# Altium schematic sheet Sheet1.SchDoc
size A; SheetNumber: 1; SheetTotal: 1
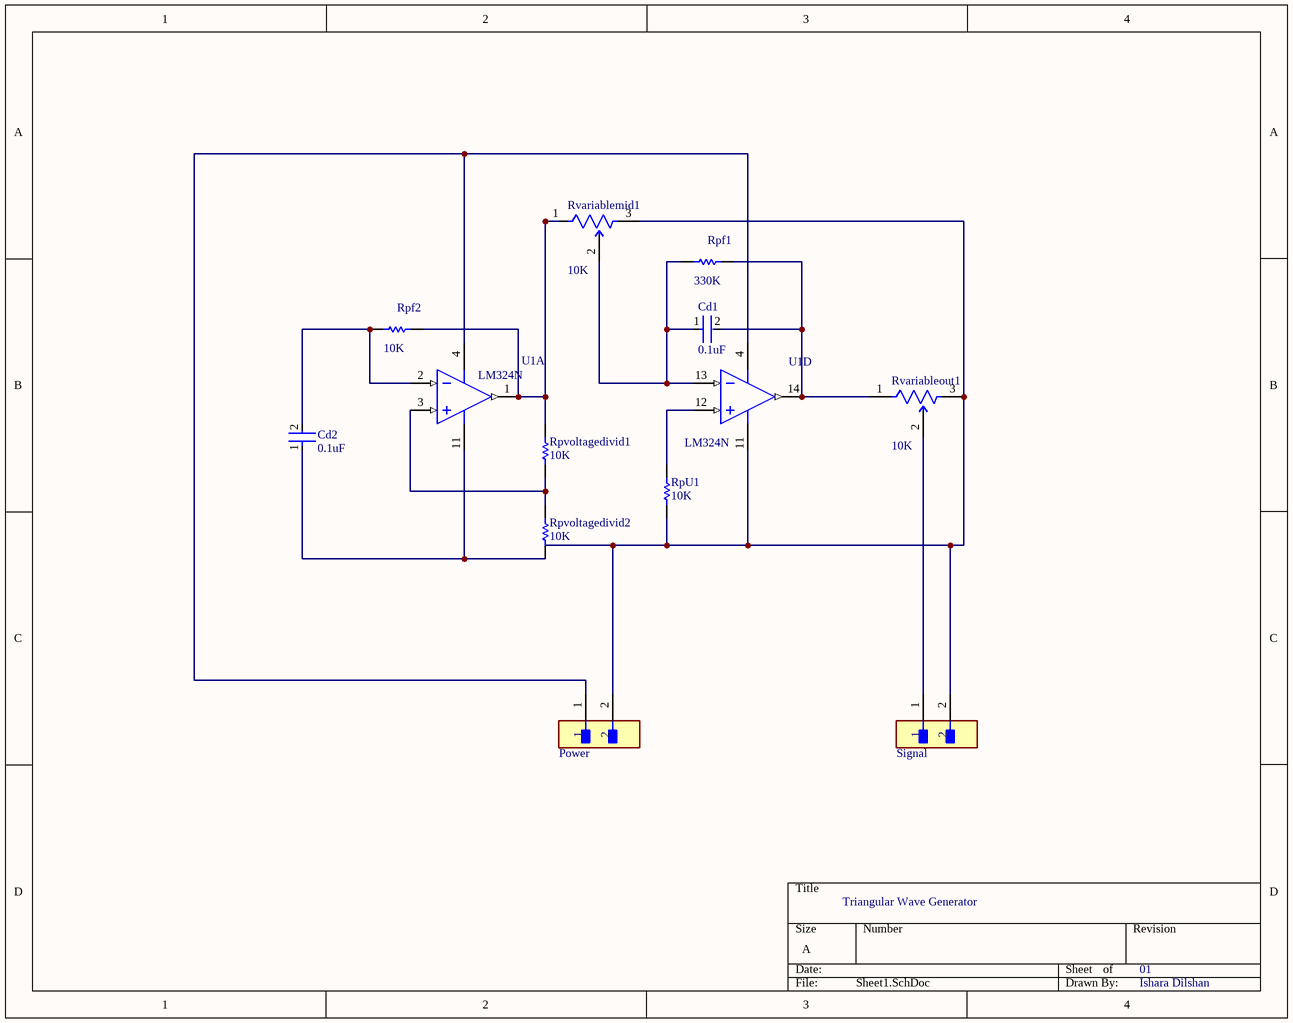
[diagram p0: Sheet1.SchDoc]

## Parts
Cd1  0.1uF  [FP-RCE0K1-MFG]
Cd2  0.1uF  [FP-RCE0K1-MFG]
Power  (no value)  [FP-B2B-XH-A_LF_SN-MFG]
Rpf1  330K  [OMTE-RES7X2.5-2]
Rpf2  10K  [OMTE-RES7X2.5-2]
RpU1  10K  [OMTE-RES7X2.5-2]
Rpvoltagedivid1  10K  [OMTE-RES7X2.5-2]
Rpvoltagedivid2  10K  [OMTE-RES7X2.5-2]
Rvariablemid1  10K  [FP-3296W-MFG]
Rvariableout1  10K  [FP-3296W-MFG]
Signal  (no value)  [FP-B2B-XH-A_LF_SN-MFG]
U1  LM324N  [N0014A]  (parts A,D of 4)

## Nets
NetCd1_1: Cd1.1 Rpf1.1 Rvariablemid1.2(WIPER) U1.13(IN4-)
NetCd1_2: Cd1.2 Rpf1.2 Rvariableout1.1(CCW) U1.14(OUT4)
NetCd2_1: Cd2.1 Rpvoltagedivid2.1 U1.11(GND)
NetCd2_2: Cd2.2 Rpf2.1 U1.2(IN1-)
NetPower_1: Power.1 U1.4(V+)
NetPower_2: Power.2 RpU1.1 Rvariablemid1.3(CW) Rvariableout1.3(CW) Signal.2 U1.11(GND)
NetRpf2_2: Rpf2.2 Rpvoltagedivid1.2 Rvariablemid1.1(CCW) U1.1(OUT1)
NetRpU1_2: RpU1.2 U1.12(IN4+)
NetRpvoltagedivid1_1: Rpvoltagedivid1.1 Rpvoltagedivid2.2 U1.3(IN1+)
NetRvariableout1_2: Rvariableout1.2(WIPER) Signal.1

## Notes on the sheet
- Triangular Wave Generator
- 01
- Ishara Dilshan

## Library data of the parts
Cd1 Cd2 = CMP-06035-026251-1: Cap Ceramic 27pF 50V C0G ±5% Radial 5mm +125°C Automotive Bulk; Lead Diameter: 0.5mm; Lead/Base Style: Formed Leads; Height: 3.5mm; Mount: Through Hole; Height - Seated (Max): 0.138inch; Min Operating Temperature: -55°C; Package Quantity: 1; Width: 0.098inch; Lead Pitch: 0.197inch; Capacitance: 27pF; Voltage Rating: 50V; Max Operating Temperature: 125°C; Case/Package: Radial; Termination: Radial; Voltage Rating (DC): 50V; Packaging: Tape and Reel; Tolerance: 5%; Resistor Type: Ceramic; Dielectric: C0G; Length: 0.142inch; Ratings: AEC-Q200
Power Signal = CMP-2000-05888-3: CONN HEADER VERT 2POS 2.5MM; Current Rating: 3A; Voltage Rating: 250V; Number of Contacts: 2; Contact Resistance: 20mR; Wire/Cable Gauge: 22AWG; Insulation Resistance: 1GR; Connector Type: Male Pin; Packaging: Bulk; Contact Material: Brass; Lead Free: Lead Free; Orientation: Straight; Contact Plating: Tin; Max Current Rating: 3A; Termination: Solder; Fastening Type: Detent; Depth: 5.75mm; Housing Material: Polyamide; REACH SVHC: No SVHC; Series: XH; Voltage Rating (AC): 250V; Number of Positions: 2; Color: Natural; Contact Type: Male Pin; Max Voltage Rating (DC): 250V; Pitch: 2.5mm; Lead Pitch: 2.5mm; Mount: Through Hole; Max Operating Temperature: 85°C; Length: 7.4mm; Max Voltage Rating (AC): 250V; Min Operating Temperature: -25°C; Number of Rows: 1; Housing Color: White
Rpf1 = CMP-2000-06865-1: Little Demon(R) Carbon Composition Molded OD Series, 250 V, 10 KOhm, +/-5%, -70 to 130 degC, 2-Pin THD, RoHS, Bulk; PartNumber: OD103JE; Manufacturer: Ohmite; Resistance (Ohms): 10k; Power Rating: 0.25W; Power (Watts): 0.25W,1/4W; Tolerance: ±5%; Online Catalog: OD,OF,OASeries,LittleDemon®; Catalog Drawings: OD,OF,OASeries; EDA / CAD Models: DownloadfromAcceleratedDesigns; Mounting Technology: ThroughHole; Datasheet Version: 06/2016; RoHS Information: LittleDemon"E"SeriesMaterialDeclaration; Number of Terminations: 2; Temperature Coefficient: -; Height: -; Composition: CarbonComposition; Package Description: 2-Pin THD Resistor, Body 7 x 2.5 mm, Lead Dia. 0.6 mm; Size / Dimension: 0.098"Diax0.276"L(2.50mmx7.00mm); Category: Resistors; Manufacturer URL: http://www.ohmite.com/; Features: PulseWithstanding; Family: ThroughHoleResistors; Supplier Device Package: Axial; Package / Case: Axial; Standard Package: 100; Package Reference: RES7X2.5; Operating Temperature: -; Series: LittleDemon®OD; Datasheet URL: http://www.ohmite.com/cat/res_od_of_oa.pdf; Packaging: Bulk
Rpf2 RpU1 Rpvoltagedivid1 Rpvoltagedivid2 = CMP-2000-06865-1: Little Demon(R) Carbon Composition Molded OD Series, 250 V, 10 KOhm, +/-5%, -70 to 130 degC, 2-Pin THD, RoHS, Bulk; PartNumber: OD103JE; Manufacturer: Ohmite; Power Rating: 0.25W; Power (Watts): 0.25W,1/4W; Tolerance: ±5%; Online Catalog: OD,OF,OASeries,LittleDemon®; Catalog Drawings: OD,OF,OASeries; EDA / CAD Models: DownloadfromAcceleratedDesigns; Mounting Technology: ThroughHole; Datasheet Version: 06/2016; RoHS Information: LittleDemon"E"SeriesMaterialDeclaration; Number of Terminations: 2; Temperature Coefficient: -; Height: -; Resistance (Ohms): 10k; Composition: CarbonComposition; Package Description: 2-Pin THD Resistor, Body 7 x 2.5 mm, Lead Dia. 0.6 mm; Size / Dimension: 0.098"Diax0.276"L(2.50mmx7.00mm); Category: Resistors; Manufacturer URL: http://www.ohmite.com/; Features: PulseWithstanding; Family: ThroughHoleResistors; Supplier Device Package: Axial; Package / Case: Axial; Standard Package: 100; Package Reference: RES7X2.5; Operating Temperature: -; Series: LittleDemon®OD; Datasheet URL: http://www.ohmite.com/cat/res_od_of_oa.pdf; Packaging: Bulk
Rvariablemid1 Rvariableout1 = CMP-07234-000043-1: TRIMMER 50K OHM 0.5W PC PIN TOP; Manufacturer Series: 3296; Resistance Tolerance: 10%; Actuator Orientation: Vertical; Resistance: 50kR; Number of Turns: 25; Power Rating: 500mW; Insulation Resistance: 1GR; Actuator Type: SCREW; Resistance Law: Linear; Number of Terminals/Pins: 3; Temperature Coefficient: 100ppm/°C; Weight: 0.03oz; Length: 9.53mm; Package Quantity: 50; Resistor Type: Cermet; Min Operating Temperature: -55°C; Termination: Pin; Radiation Hardening: No; Terminal Finish: Tin; Height: 0.395inch; Depth: 4.83mm; REACH SVHC: No SVHC; Width: 9.53mm; Packaging: Rail/Tube; RoHS Compliant: Yes; Mount: Panel; Max Power Dissipation: 500mW; Taper: Linear; Color: Blue; Technology: CERMET; Lead Free: Lead Free; Max Operating Temperature: 125°C; Number of Pins: 3; Type: Potentiometer; Military Standard: Not; Contact Plating: Tin; Series: 3296; Tolerance: 10%
U1 = CMP-0055-00082-3: Low Power Quad Operational Amplifier, 14-pin MDIP; Manufacturer: Texas Instruments; CompType: Amplifiers; PowerWise: N; PackageTopMarking: NSUZXYYTTE#*LM324N; PackageDescription: MDIP, .750 x .250 x.130in, 14 Lead, .100in Pitch; Package Reference: N0014A; RoHS: N; Code_JEDEC: MS-001-AA; ComponentLink1URL: http://www.ti.com/general/docs/lit/getliterature.tsp?genericPartNumber=LM324&fileType=pdf; ComponentLink1Description: Datasheet URL; PinCount: 14